# Altium schematic sheet button1.SchDoc: BUTTONS
size 431 x 279 mm; Date: 02/07/2022; ApprovedBy: RTZ,HYW; CheckedBy: RTZ,HYW; Author: RTZ,HYW; CompanyName: Upenn; DrawnBy: RTZ,HYW; Engineer: RTZ,HYW; Organization: Upenn ESE; Address1: Electrical Engineering; Address2: 200 South 33rd St; Address3: Philadelphia; Address4: PA, 19104; SheetNumber: 11; SheetTotal: 11; ENG_APP_DATE: 02/15/22; DSN_APP_DATE: 02/15/22; CHK_APP_DATE: 02/15/22; DOC_NO_ASSY_DWG: TBD; DOC_NO_FAB_DWG: TBD; PCB_DWG_NO: TBD; Project: SimonSayGame; DESIGN_ITEM: 1.0; DOC_NO_SCH_DWG: TBD; SCH_SCALE: NA; CAGE_CODE: TBD; Time: 13:18
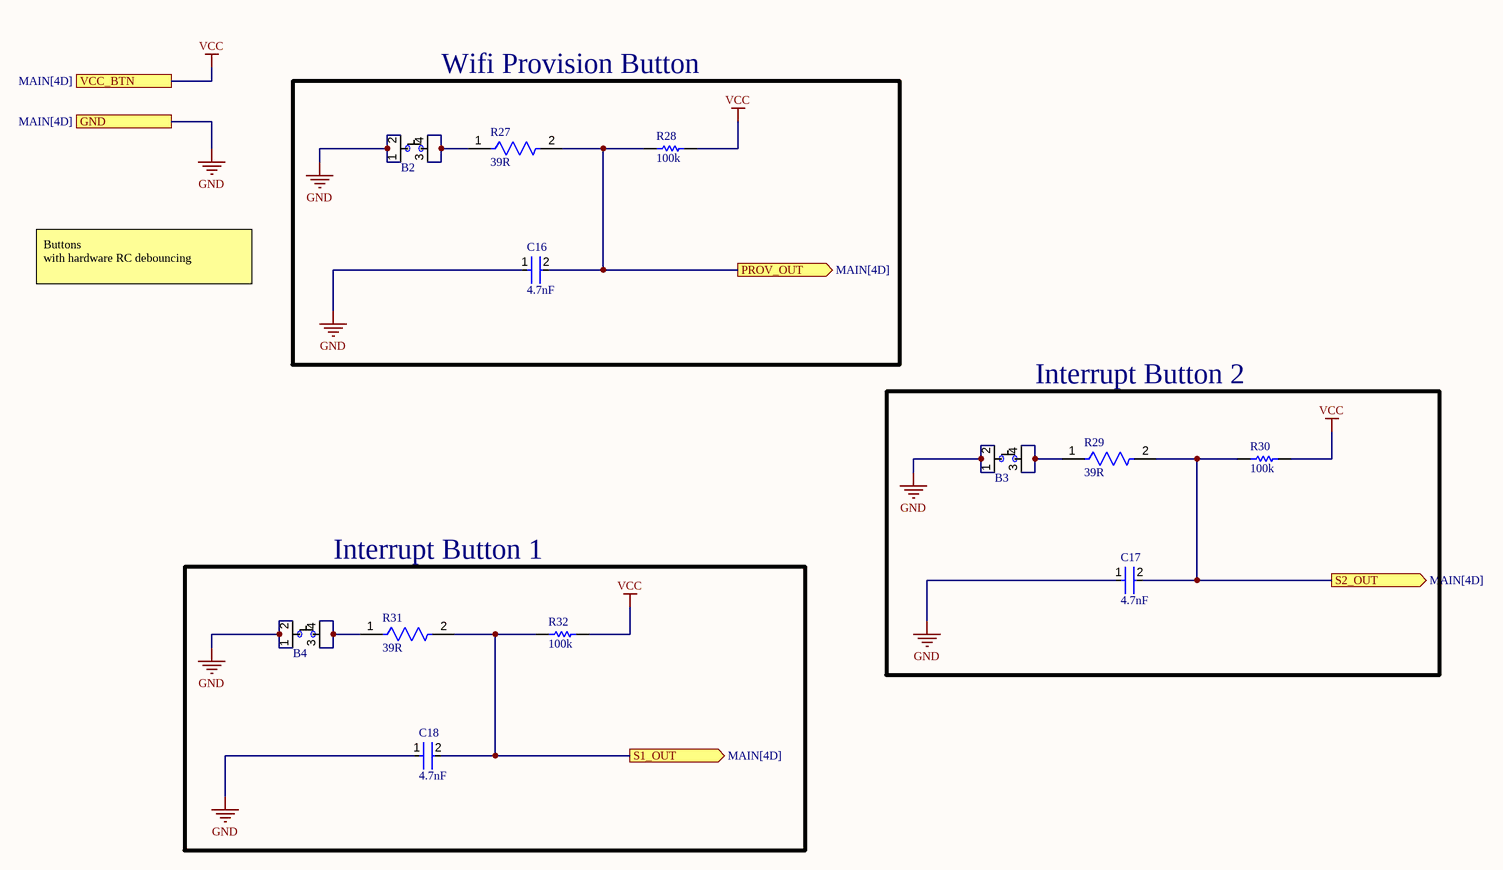
[diagram p0: button1.SchDoc]

## Parts
B2  PTS810 SJK 250 SMTR LFS  [PTS810 SJK 250 SMTR LFS]  (value not drawn)
B3  PTS810 SJK 250 SMTR LFS  [PTS810 SJK 250 SMTR LFS]  (value not drawn)
B4  PTS810 SJK 250 SMTR LFS  [PTS810 SJK 250 SMTR LFS]  (value not drawn)
C16  4.7nF  [FP-0603-L_1_6_0_15-W_0_81-MFG]
C17  4.7nF  [FP-0603-L_1_6_0_15-W_0_81-MFG]
C18  4.7nF  [FP-0603-L_1_6_0_15-W_0_81-MFG]
R27  39R  [FP-CPF0603-MFG]
R28  100k  [RESC1609X55X30ML10T20]
R29  39R  [FP-CPF0603-MFG]
R30  100k  [RESC1609X55X30ML10T20]
R31  39R  [FP-CPF0603-MFG]
R32  100k  [RESC1609X55X30ML10T20]

## Blocks framed on the sheet
Wifi Provision Button: B2 C16 R27 R28
Interrupt Button 2: B3 C17 R29 R30
Interrupt Button 1: B4 C18 R31 R32

## Ports
GND (see MAIN[4D]), PROV_OUT (out, see MAIN[4D]), S1_OUT (out, see MAIN[4D]), S2_OUT (out, see MAIN[4D]), VCC_BTN (see MAIN[4D])

## Nets
GND: B2.1 B2.2 B3.1 B3.2 B4.1 B4.2 C16.1 C17.1 C18.1 ; port GND
VCC: R28.2 R30.2 R32.2 ; port VCC_BTN
PROV_OUT: C16.2 R27.2 R28.1 ; port PROV_OUT
S1_OUT: C18.2 R31.2 R32.1 ; port S1_OUT
S2_OUT: C17.2 R29.2 R30.1 ; port S2_OUT
NetB2_3: B2.3 B2.4 R27.1
NetB3_3: B3.3 B3.4 R29.1
NetB4_3: B4.3 B4.4 R31.1

## Notes on the sheet
- Buttons
  with hardware RC debouncing
- DWG. NO.
- REV.
- SHT.
- THIS DOCUMENT AND THE DATA DISCLOSED HEREIN OR HEREWITH IS THE PROPERTY OF ALTIUM LIMITED AND MAY BE FREELY DISTRIBUTED IN WHOLE. NO RIGHTS ARE RESERVED OR EXPRESS OR IMPLIED WARANTEE GIVEN.
- REVISION
- DESCRIPTION
- DATE
- APPROVED
- ENG:
- APPROVALS
- PROJECT
- DSN:
- CHK:
- REFERENCE DOCUMENTS
- PROJECT REVISION:
- TITLE
- DOCUMENT REVISION:
- DESIGN ITEM:
- BOM:
- FAB DWG:
- PCB DWG:
- ASSY DWG:
- SCALE:
- SIZE
- B
- CAGE CODE
- FILE NAME
- DWG NO.
- SHEET
- OF
- REV

## Library data of the parts
B2-B4 = PTS810 SJK 250 SMTR LFS: SWITCH TACTILE SPST-NO 0.05A 16V Tactile Switch SPST-NO Top Actuated Surface Mount; Manufacturer: ITT /  C&K Components; Part # Aliases: Y97LT25B5DBFP; Operating Force: 2.6 N; Actuator: Oval; Current Rating: 50 mA; Voltage Rating DC: 16 VDC; Contact Form: SPST; Switch Function: OFF - (ON); Mounting Direction: Straight; Stem Height: 2.5 mm; Brand: C&K Components; Travel: 0.15 mm; Manufacturer Part Number: PTS810SJK250SMTRLFS; Product Category: Tactile Switches; RoHS: Details; Termination Style: J Form Lead; Mounting Style: SMD/SMT; Color: White; Packaging: Reel; Contact Plating: Silver; Operating Temperature Range: - 40 C to + 85 C; Series: PTS810; Factory Pack Quantity: 2900; ComponentLink1URL: https://datasheet.ciiva.com/18514/pts810-4mar13-18514061.pdf; ComponentLink1Description: https://datasheet.ciiva.com/18514/pts810-4mar13-18514061.pdf; ComponentLink2URL: https://datasheet.ciiva.com/18514/pts810-4mar13-18514062.pdf; ComponentLink2Description: https://datasheet.ciiva.com/18514/pts810-4mar13-18514062.pdf; ComponentLink3URL: https://datasheet.ciiva.com/18514/pts810-4mar13-18514063.pdf; ComponentLink3Description: https://datasheet.ciiva.com/18514/pts810-4mar13-18514063.pdf; Supplier 1: Digi-Key; Supplier Part Number 1: CKN10503CT-ND
C16-C18 = CMP-2006-04439-2: General Purpose Ceramic Capacitor, 0603, 4.7nF, 10%, X7R, 15%, 50V; Dissipation Factor: 2.5%; Dielectric: X5R; Voltage: 50V; Packaging: Tape and Reel; Package Quantity: 1; Radiation Hardening: No; Voltage Rating: 50V; Depth: 0.81mm; Capacitance: 4.7nF; Case/Package: 0603; Case Code (Imperial): 0603; Tolerance: 10%; Height: 0.9mm; Min Operating Temperature: -55°C; Max Operating Temperature: 125°C; Length: 1.6mm; REACH SVHC: No SVHC; Case Code (Metric): 1608; Contact Plating: Tin; Construction: Flat; Thickness: 0.035inch; Number of Pins: 2; Termination: SMD/SMT; RoHS Compliant: Yes; Mount: Surface Mount; Series: -; Lead Free: Lead Free; Width: 0.81mm; Dielectric Material: Ceramic; Voltage Rating (DC): 50V
R27 R29 R31 = CMP-03211-000431-1: RES SMD 39Ω 0.1% 1/16W 0603; Manufacturer Part Number: CPF0603B39RE1; Manufacturer: TE Connectivity; Voltage Rating: 50V; Power Rating: 0.063W; Temperature Coefficient: 25ppm/°C; Device Class L3: Chip SMD Resistors; ComponentLink2URL: https://www.te.com/commerce/DocumentDelivery/DDEController?Action=showdoc&DocId=Data+Sheet%7F1773200%7FM%7Fpdf%7FEnglish%7FENG_DS_1773200_M.pdf%7F3-1676481-2; packaging: 1k Reel; RoHS: TRUE; Lead Free: Yes; Series: CPF; Category: Res; Tolerance: 0.1%; Octopart: https://octopart.com/cpf0603b39re1-te+connectivity-9539401; Temperature Range High: +155°C; Device Class L2: Resistors; Temperature Range Low: -55°C; Value: 39Ω; Height: 0.55mm; Package: CPF0603; Temperature: -55°C to +155°C; Automotive: No; Resistance: 39Ω; ComponentLink2Description: Datasheet; Device Class L1: Passive Components; Ipc Land Pattern Name: RESC15580X45; octopart_url: https://octopart.com/cpf0603b39re1-te+connectivity-9539401; Composition: Thin Film
R28 R30 R32 = CMP-2000-03685-1: Manufacturer: Vishay Dale; Part Number: TNPW0603100KBEEA